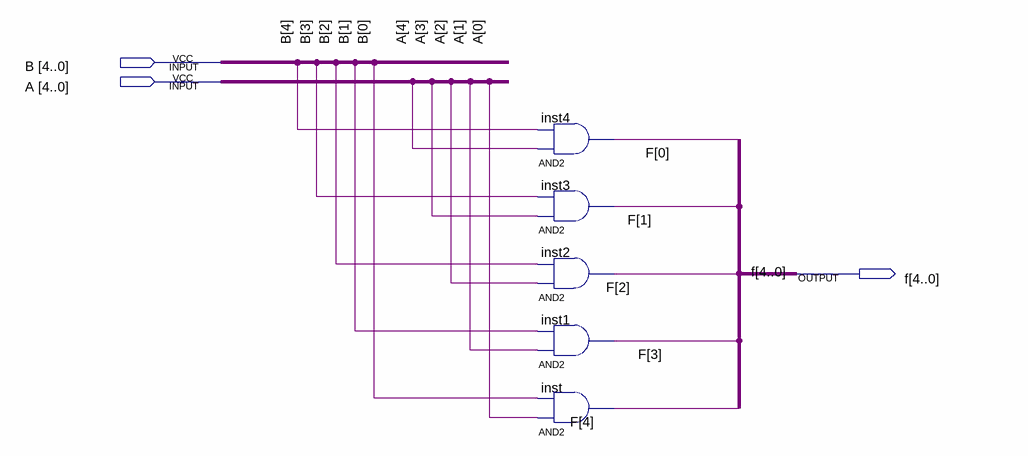
[diagram p0: schematic sheet]
// Quartus schematic and5bit.bdf as structural Verilog: 5 symbols, 3 pins
module and5bit (
  input  [4:0] B,
  input  [4:0] A,
  output [4:0] f
);

  and inst4 (f[0], A[4], B[4]);
  and inst3 (f[1], A[3], B[3]);
  and inst2 (f[2], A[2], B[2]);
  and inst1 (f[3], A[1], B[1]);
  and inst (f[4], A[0], B[0]);
endmodule
